# EAGLE design ded_pribor03-razmetlka (EAGLE 5.00)
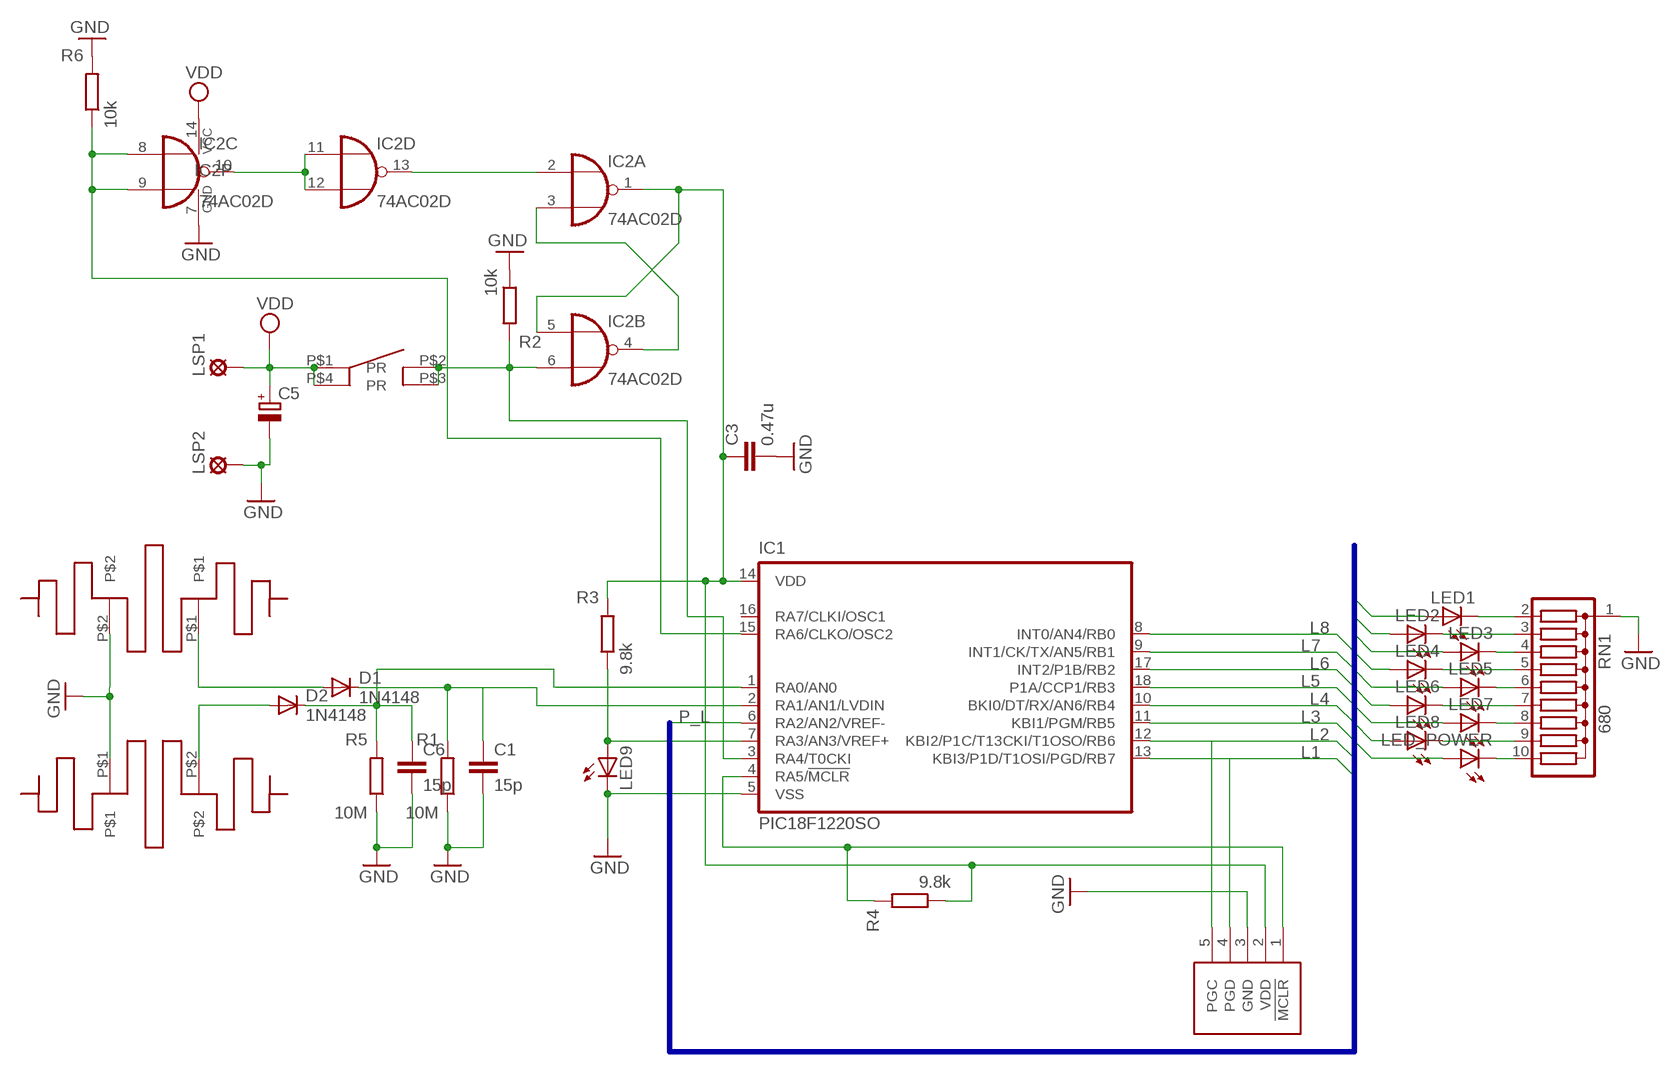
[diagram p0: schematic, sheet 1]

## Parts
C1  15p  C-EUC1206  [C1206]
C3  0.47u  C-EUC1206  [C1206]
C5  CPOL-EUSMCA  [SMC_A]
C6  15p  C-EUC1206  [C1206]
D1  1N4148  [DO35-10]
D2  1N4148  [DO35-10]
IC1  PIC18F1220SO  [SO-18W]
IC2  74AC02D  [SO14]
LED1  LED3MM  [LED3MM]
LED2  LED3MM  [LED3MM]
LED3  LED3MM  [LED3MM]
LED4  LED3MM  [LED3MM]
LED5  LED3MM  [LED3MM]
LED6  LED3MM  [LED3MM]
LED7  LED3MM  [LED3MM]
LED8  LED3MM  [LED3MM]
LED9  LED5MM  [LED5MM]
LED_POWER  LED3MM  [LED3MM]
LSP1  SE14  [SE14]
LSP2  SE14  [SE14]
R1  10M  R-EU_M1206  [M1206]
R2  10k  R-EU_M1206  [M1206]
R3  9.8k  R-EU_M1206  [M1206]
R4  9.8k  R-EU_M1206  [M1206]
R5  10M  R-EU_M1206  [M1206]
R6  10k  R-EU_M1206  [M1206]
RN1  680  G09R  [SIL10]
U$1  TIKBUTTON01  [TIKBUTTON01]
U$2  ANTENNA  [ANT!]
U$3  ANTENNA  [ANT!]
U$4  PIC-PROG-CON  [PIC-PROG-CON]

## Nets
GND [my_def]: C1.2 C3.2 C5.- C6.2 IC1.5(VSS) IC2.7(P:GND) LED9.K(C) LSP2.MP R1.1 R2.1 R5.1 R6.2 RN1.1 U$2.P$1 U$3.P$2 U$4.3(GND)
L1: IC1.13(KBI3/P1D/T1OSI/PGD/RB7) LED1.A U$4.4(PGD)
L2: IC1.12(KBI2/P1C/T13CKI/T1OSO/RB6) LED2.A U$4.5(PGC)
L3: IC1.11(KBI1/PGM/RB5) LED3.A
L4: IC1.10(BKI0/DT/RX/AN6/RB4) LED4.A
L5: IC1.18(P1A/CCP1/RB3) LED5.A
L6: IC1.17(INT2/P1B/RB2) LED6.A
L7: IC1.9(INT1/CK/TX/AN5/RB1) LED7.A
L8: IC1.8(INT0/AN4/RB0) LED8.A
N$1: C1.1 D1.C IC1.2(RA1/AN1/LVDIN) R1.2
N$2 [my_def]: C6.1 D2.C IC1.1(RA0/AN0) R5.2
N$3: LED1.K(C) RN1.2
N$4: LED2.K(C) RN1.3
N$5: LED3.K(C) RN1.4
N$6: LED4.K(C) RN1.5
N$7: LED5.K(C) RN1.6
N$8: LED6.K(C) RN1.7
N$9: LED7.K(C) RN1.8
N$10: LED8.K(C) RN1.9
N$11: LED_POWER.K(C) RN1.10
N$12: C3.1 IC1.14(VDD) IC2.1(A:O) IC2.5(B:I0) R3.2 R4.1 U$4.2(VDD)
N$13: IC2.3(A:I1) IC2.4(B:O)
N$14: D1.A U$3.P$1
N$15: IC2.2(A:I0) IC2.13(D:O)
N$16: IC1.3(RA4/T0CKI) IC2.6(B:I1) R2.2 U$1.P$2(R) U$1.P$3(R)
N$17: D2.A U$2.P$2
N$18: IC1.7(RA3/AN3/VREF+) LED9.A R3.1
N$22: IC2.10(C:O) IC2.11(D:I0) IC2.12(D:I1)
N$23: IC1.15(RA6/CLKO/OSC2) IC2.8(C:I0) IC2.9(C:I1) R6.1
N$24: IC1.4(RA5/!MCLR) R4.2 U$4.1(!MCLR)
P_L: IC1.6(RA2/AN2/VREF-) LED_POWER.A
VDD [my_def]: C5.+ IC2.14(P:VCC) LSP1.MP U$1.P$1(P) U$1.P$4(P)
Unconnected: IC1.16(RA7/CLKI/OSC1)

## Buses
L1,L2,L3,L4,L5,L6,L7,L8,P_L

## Library data of the parts
C1 C3 C6 = rcl:C-EU: CAPACITOR, European symbol
C5 = rcl:CPOL-EU: POLARIZED CAPACITOR, European symbol
D1 D2 = diode:1N4148: DIODE high speed (Philips)
IC1 = microchip:PIC18F1*20: 18/20/28-Pin High-Performance, Enhanced Flash Microcontrollers with 10-bit A/D and nanoWatt Technology Source: ww1.microchip.com/downloads/en/DeviceDoc/39605c.pdf
IC2 = 74xx-eu:74*02: Quad 2-input NOR gate
LED1-LED9 LED_POWER = led:LED: LED OSRAM: - CHIPLED LG R971, LG N971, LY N971, LG Q971, LY Q971, LO R971, LY R971 LH N974, LH R974 LS Q976, LO Q976, LY Q976 LO Q996 - Hyper CHIPLED LW Q18S LB Q993, LB Q99A, LB R99A - SideLED LS A670, LO A670, LY A670, LG A670, LP A670 LB A673, LV A673, LT A673, LW A673 LH A674 LY A675 LS A676, LA A676, LO A676, LY A676, LW A676 LS A679, LY A679, LG A679 - Hyper Micro SIDELED® LS Y876, LA Y876, LO Y876, LY Y876 LT Y87S - SmartLED LW L88C, LW L88S LB L89C, LB L89S, LG L890 LS L89K, LO L89K, LY L89K LS L896, LA L896, LO L896, LY L896 - TOPLED LS T670, LO T670, LY T670, LG T670, LP T670 LSG T670, LSP T670, LSY T670, LOP T670, LYG T670 LG T671, LOG T671, LSG T671 LB T673, LV T673, LT T673, LW T673 LH T674 LS T676, LA T676, LO T676, LY T676, LB T676, LH T676, LSB T676, LW T676 LB T67C, LV T67C, LT T67C, LS T67K, LO T67K, LY T67K, LW E67C LS E67B, LA E67B, LO E67B, LY E67B, LB E67C, LV E67C, LT E67C LW T67C LS T679, LY T679, LG T679 LS T770, LO T770, LY T770, LG T770, LP T770 LB T773, LV T773, LT T773, LW T773 LH T774 LS E675, LA E675, LY E675, LS T675 LS T776, LA T776, LO T776, LY T776, LB T776 LHGB T686 LT T68C, LB T68C - Hyper Mini TOPLED® LB M676 - Mini TOPLED Santana® LG M470 LS M47K, LO M47K, LY M47K Source: http://www.osram.convergy.de - LUMILED® LXK2-PW12-R00, LXK2-PW12-S00, LXK2-PW14-U00, LXK2-PW14-V00 LXK2-PM12-R00, LXK2-PM12-S00, LXK2-PM14-U00 LXK2-PE12-Q00, LXK2-PE12-R00, LXK2-PE12-S00, LXK2-PE14-T00, LXK2-PE14-U00 LXK2-PB12-K00, LXK2-PB12-L00, LXK2-PB12-M00, LXK2-PB14-N00, LXK2-PB14-P00, LXK2-PB14-Q00 LXK2-PR12-L00, LXK2-PR12-M00, LXK2-PR14-Q00, LXK2-PR14-R00 LXK2-PD12-Q00, LXK2-PD12-R00, LXK2-PD12-S00 LXK2-PH12-R00, LXK2-PH12-S00 LXK2-PL12-P00, LXK2-PL12-Q00, LXK2-PL12-R00 Source: www.luxeon.com
LSP1 LSP2 = solpad:SE14: SOLDER PAD E1553, drill 1,4mm, distributor Buerklin, 07F820
R1-R6 = rcl:R-EU_: RESISTOR, European symbol
RN1 = resistor-sil:G09R: SIL RESISTOR
U$1 = buttons:TIKBUTTON01: button tik
U$2 U$3 = antenna:ANTENNA: ANTENNA ded
U$4 = pic_prog_con:PIC-PROG-CON: pic prog con pic_prog pic_prog_con

## Net classes
2 net12: width 0.305 mm
3 my_def: width 0.508 mm

## Board
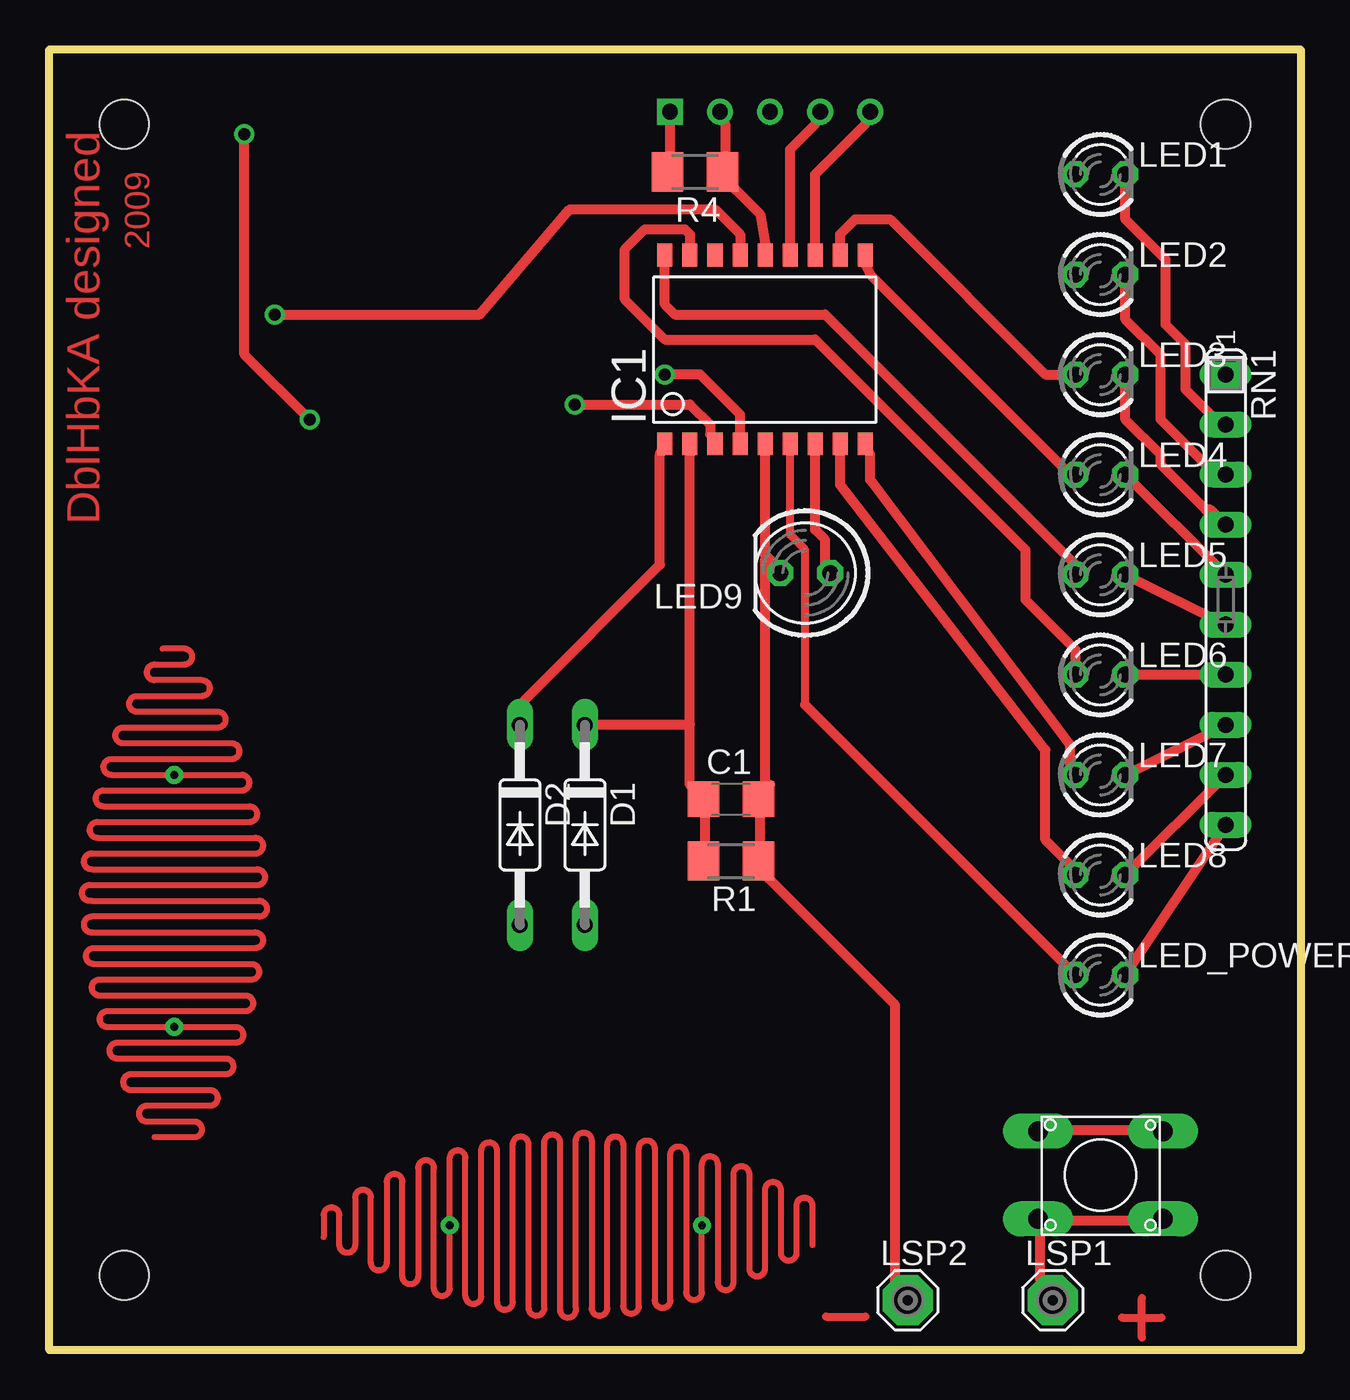
[diagram p1: board, top side]
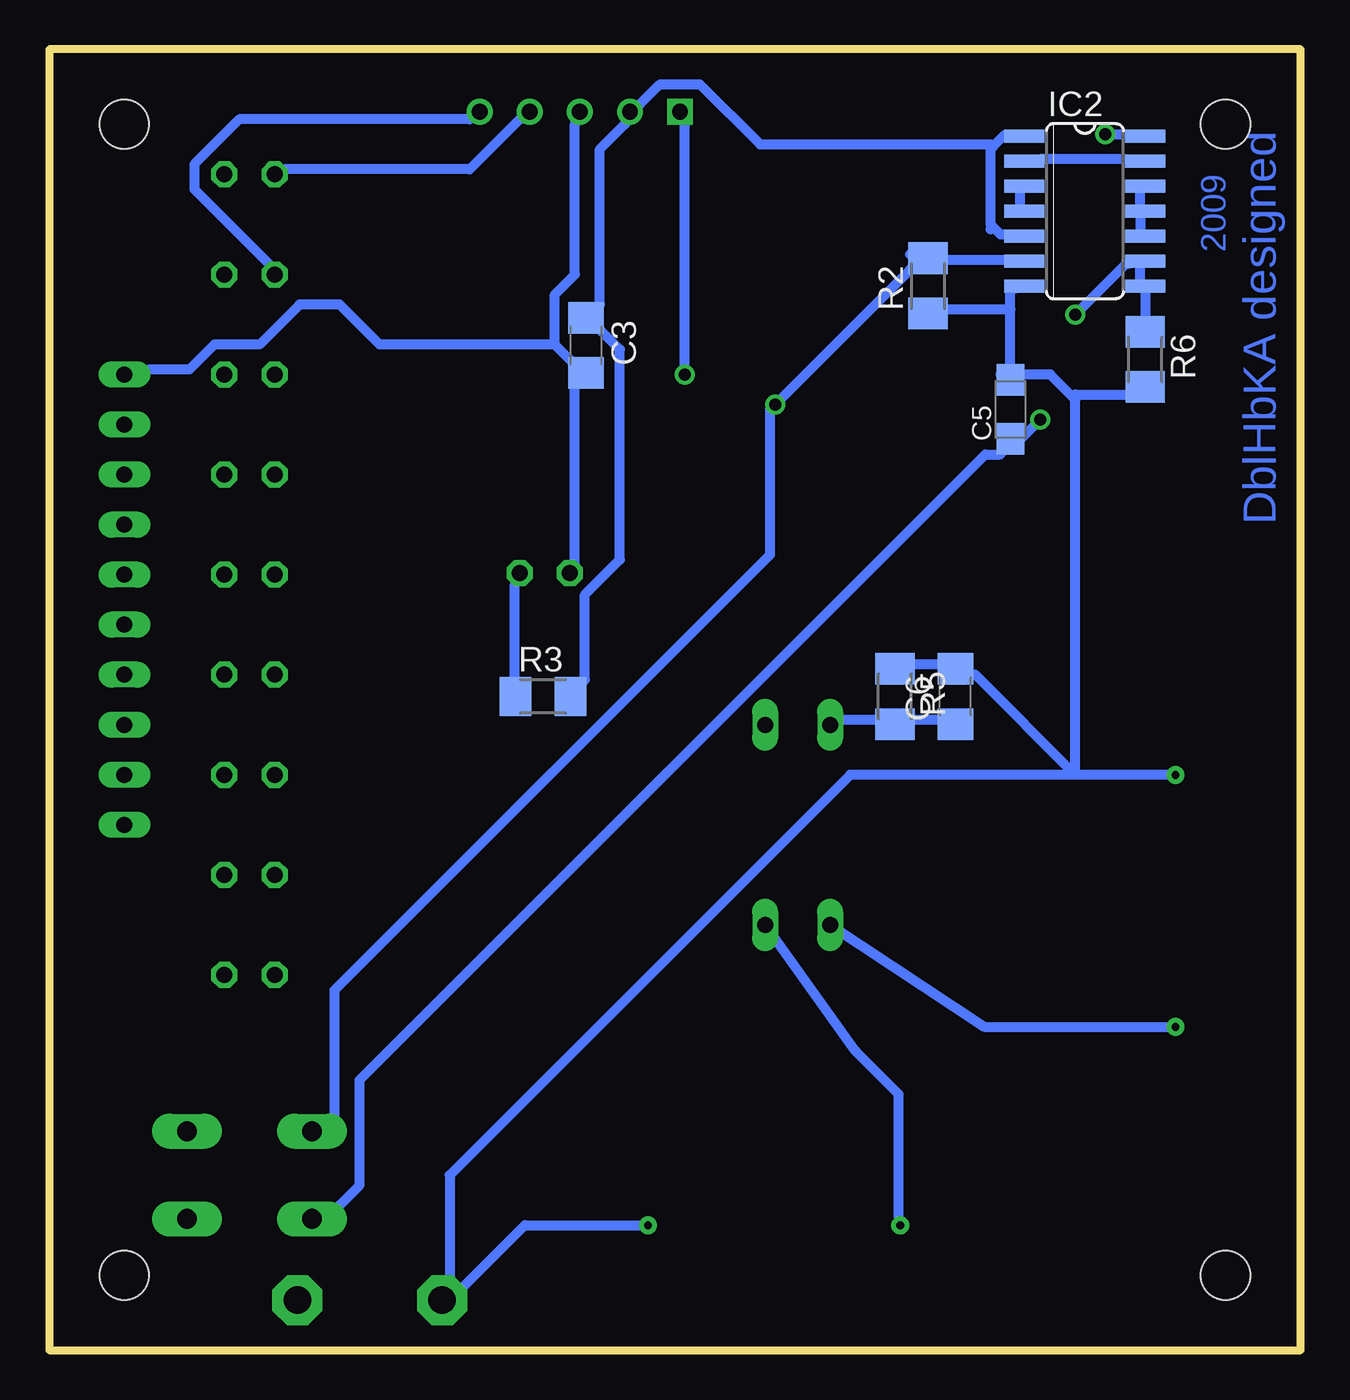
[diagram p2: board, bottom side, seen from below]

Size 63.5 x 66.04 mm. Coordinates in mm from the lower left corner, seen from the top.
Outline: 0,0 0,66.04 63.5,66.04 63.5,0 0,0
Copper layers (1*16): Top 0.035mm / dielectric 1.5mm / Bottom 0.035mm
Design rules "default *": minimum track width 20mil, minimum drill 24mil, track to track 20mil, track to pad 15mil, pad to pad 8mil, via to via 8mil, smd to smd 8mil, copper to edge 40mil, drill to drill 8mil, minimum pad ring 10mil, minimum via ring 8mil, stop-mask expansion 4mil, vias tented up to drill 0mil, thermal gap 10mil
Holes 2.5 mm at 3.81,3.81 3.81,62.23 59.69,3.81 59.69,62.23

### Footprints (pad centres in the part's own frame; a part is rotated, then mirrored left to right if it is on the bottom)
C1206 = smd 1.6 x 1.8: 1 -1.4,0; 2 1.4,0
SMC_A = smd 1.6 x 1.4: + -1.5,0; - 1.5,0
DO35-10 = drill 0.813 long: A 5.08,0; C -5.08,0
SO-18W = smd 0.762 x 1.143: 1 -5.08,-4.788; 2 -3.81,-4.788; 3 -2.54,-4.788; 4 -1.27,-4.788; 5 0,-4.788; 6 1.27,-4.788; 7 2.54,-4.788; 8 3.81,-4.788; 9 5.08,-4.788; 10 5.08,4.788; 11 3.81,4.788; 12 2.54,4.788; 13 1.27,4.788; 14 0,4.788; 15 -1.27,4.788; 16 -2.54,4.788; 17 -3.81,4.788; 18 -5.08,4.788
SO14 = smd 0.66 x 2.032: 1 -3.81,-3.073; 2 -2.54,-3.073; 3 -1.27,-3.073; 4 0,-3.073; 5 1.27,-3.073; 6 2.54,-3.073; 7 3.81,-3.073; 8 3.81,3.073; 9 2.54,3.073; 10 1.27,3.073; 11 0,3.073; 12 -1.27,3.073; 13 -2.54,3.073; 14 -3.81,3.073
LED3MM = drill 0.813 octagon: A -1.27,0; K 1.27,0
LED5MM = drill 0.813 octagon: A -1.27,0; K 1.27,0
SE14 = drill 1.397 pad 2.54 octagon: MP 0,0
M1206 = smd 1.6 x 2: 1 -1.4,0; 2 1.4,0
SIL10 = drill 0.813 long: 1 -11.43,0; 2 -8.89,0; 3 -6.35,0; 4 -3.81,0; 5 -1.27,0; 6 1.27,0; 7 3.81,0; 8 6.35,0; 9 8.89,0; 10 11.43,0
TIKBUTTON01 = drill 1 pad 1.778 long: P$1 -2.223,-3.175; P$2 2.223,-3.175; P$3 2.223,3.175; P$4 -2.223,3.175
ANT! = drill 0.4 pad 0.8 round: P$1 0,0; P$2 12.8,0
PIC-PROG-CON = drill 0.8 square: 1 -3.81,0 | drill 0.8 round: 2 -1.27,0; 3 1.27,0; 4 3.81,0; 5 6.35,0

### Placement (x,y rotation side)
C1  34.6,27.98 0 top
C3  36.27,51.01 270 bottom
C5  14.73,47.75 90 bottom
C6  17.53,33.19 90 bottom
D1  27.18,26.67 270 top
D2  23.88,26.67 270 top
IC1  36.32,50.8 0 top
IC2  10.95,57.82 270 bottom
LED1  53.34,59.69 0 top
LED2  53.34,54.61 0 top
LED3  53.34,49.53 0 top
LED4  53.34,44.45 0 top
LED5  53.34,39.37 0 top
LED6  53.34,34.29 0 top
LED7  53.34,29.21 0 top
LED8  53.34,24.13 0 top
LED9  38.36,39.45 180 top
LED_POWER  53.34,19.05 0 top
LSP1  50.91,2.54 0 top
LSP2  43.56,2.54 0 top
R1  34.6,24.84 180 top
R2  18.91,54.04 90 bottom
R3  38.44,33.19 0 bottom
R4  32.77,59.82 180 top
R5  20.59,33.19 270 bottom
R6  7.89,50.29 270 bottom
RN1  59.69,38.1 270 top
U$1  53.34,8.89 90 top
U$2  6.35,29.21 270 top
U$3  20.32,6.35 0 top
U$4  35.31,62.87 0 top

### Tracks (layer width: path | path; a pad name or v marks a point on that pad's centre or on a via)
GND
  Top 0.508: C1.2 36.58,28.7 | LSP2.MP 42.93,3.56 42.93,17.53 36.58,23.88 R1.1 36.07,25.65 36.07,27.18 C1.2 | 36.45,40.26 36.83,39.88 LED9.K | 36.45,40.26 36.32,40.39 36.32,45.47 IC1.5 | C1.2 36.32,28.7 36.32,40.13 36.45,40.26
  Bottom 0.508: R5.1 19.81,34.8 18.29,34.8 C6.2 17.78,34.29 16.51,34.29 11.43,29.21 | 14.73,52.83 14.73,53.85 IC2.7 | 14.73,52.83 C5.- 15.24,49.53 12.7,49.53 11.56,48.39 | 14.73,52.83 18.03,52.83 R2.1 | U$2.P$1 11.43,29.21 | 11.56,48.39 11.43,48.26 11.43,29.21 | 43.18,2.54 39.37,6.35 U$3.P$2 33.02,6.35 | 43.18,2.54 43.18,8.89 22.86,29.21 11.43,29.21 | 43.18,2.54 LSP2.MP | R6.2 8.64,48.51 11.43,48.51 11.56,48.39 | LED9.K 36.83,39.88 36.83,49.02 C3.2 37.08,50.29 37.85,51.05 | 37.85,51.05 37.85,53.59 36.83,54.61 36.83,62.23 U$4.3 | 37.85,51.05 46.74,51.05 48.77,53.09 50.8,53.09 52.83,51.05 55.12,51.05 56.39,49.78 58.42,49.78 RN1.1
L1
  Top 0.508: IC1.13 37.59,56.13 37.59,60.96 38.86,62.23 U$4.4
  Bottom 0.508: LED1.A 51.56,59.94 42.16,59.94 39.62,62.48 U$4.4
L2
  Top 0.508: IC1.12 38.86,56.13 38.86,59.69 41.4,62.23 U$4.5
  Bottom 0.508: LED2.A 52.32,55.12 56.13,58.93 56.13,60.2 53.85,62.48 42.16,62.48 U$4.5
L3
  Top 0.508: LED3.A 50.55,49.53 42.67,57.4 40.89,57.4 40.13,56.64 40.13,55.63 40.13,55.62 IC1.11
L4
  Top 0.508: IC1.10 41.4,55.12 41.66,54.61 51.56,44.7 LED4.A
L5
  Top 0.508: LED5.A 52.07,39.88 39.37,52.58 31.75,52.58 31.24,53.09 31.24,55.37 IC1.18
L6
  Top 0.508: IC1.17 32.51,56.64 32.26,56.9 30.23,56.9 29.21,55.88 29.21,53.34 31.24,51.31 38.86,51.31 49.53,40.64 49.53,38.1 52.07,35.56 LED6.A
L7
  Top 0.508: IC1.9 41.66,45.47 41.66,44.2 51.82,30.73 51.82,29.72 LED7.A
L8
  Top 0.508: IC1.8 40.13,45.47 40.13,43.94 50.55,30.48 50.55,25.91 51.82,24.64 LED8.A
N$1
  Top 0.508: 32.51,31.75 32.51,28.7 C1.1 33.27,27.18 33.27,25.65 R1.2 | 32.51,31.75 32.51,45.47 IC1.2 | 32.51,31.75 D1.C
N$2
  Top 0.508: IC1.1 30.99,45.47 30.99,39.88 24.13,33.02 D2.C
  Bottom 0.508: C6.1 18.29,32 19.81,32 R5.2 21.34,32 23.37,32 D2.C
N$3
  Top 0.508: LED1.K 54.61,57.4 56.64,55.37 56.64,52.07 57.66,51.05 57.66,48.77 59.44,46.99 RN1.2
N$4
  Top 0.508: LED2.K 54.61,52.32 56.39,50.55 56.39,47.24 59.18,44.45 RN1.3
N$5
  Top 0.508: LED3.K 54.61,47.24 56.39,45.47 56.39,44.96 58.67,42.67 58.93,42.67 RN1.4
N$6
  Top 0.508: RN1.5 LED4.K
N$7
  Top 0.508: LED5.K RN1.6
N$8
  Top 0.508: LED6.K RN1.7
N$9
  Top 0.508: LED7.K RN1.8
N$10
  Top 0.508: LED8.K RN1.9
N$11
  Top 0.508: LED_POWER.K RN1.10
N$12
  Top 0.508: IC1.14 36.32,56.13 36.07,57.66 34.8,58.93 R4.1 34.29,60.71 34.29,62.23 U$4.2
  Bottom 0.508: 15.62,57.02 15.75,57.15 15.75,60.96 15.62,61.09 | 15.62,57.02 15.24,56.64 14.99,56.64 IC2.5 | 15.62,61.09 14.99,61.72 IC2.1 | 15.62,57.02 15.75,56.9 | R3.2 36.32,34.04 36.32,38.35 34.54,40.13 34.54,50.8 35.56,51.82 C3.1 35.56,53.09 35.56,60.96 34.29,62.23 U$4.2 33.53,63.25 32.51,64.26 30.48,64.26 27.43,61.21 15.75,61.21 15.62,61.09
N$13
  Bottom 0.508: IC2.4 14.22,57.91 14.22,58.93 IC2.3
N$14
  Bottom 0.508: U$3.P$1 20.4,6.8 20.4,13 22.6,15.2 D1.A
N$15
  Bottom 0.508: IC2.13 8.89,60.45 13.21,60.45 IC2.2
N$16  (via drill 0.61)
  Top 0.508: U$1.P$3 51.82,11.18 54.86,11.18 U$1.P$2 | v26.67,48.01 32.51,48.01 33.53,46.99 33.53,46.48 IC1.3
  Bottom 0.508: R2.2 18.03,55.37 14.99,55.37 IC2.6 | R2.2 19.81,55.63 | R2.2 19.81,54.86 v26.67,48.01 26.92,47.75 26.92,40.39 49.02,18.29 49.02,11.94 U$1.P$3
N$17
  Bottom 0.508: U$2.P$2 6.8,16.4 16,16.4 D2.A
N$18
  Top 0.508: IC1.7 38.86,45.47 38.86,41.66 39.37,41.15 39.37,39.88 LED9.A
  Bottom 0.508: R3.1 39.88,34.04 39.88,38.86 LED9.A
N$19
  Top 0.406: 39.43,1.7 41.41,1.7
N$20
  Top 0.406: 54.44,1.65 56.44,1.65
N$21
  Top 0.406: 55.44,0.65 55.44,2.65
N$22
  Bottom 0.508: IC2.10 8.13,56.64 8.13,57.66 IC2.11 8.13,57.91 8.13,58.93 IC2.12
N$23  (via drill 0.61)
  Top 0.508: IC1.15 35.05,56.64 33.78,57.91 26.42,57.91 21.84,52.58 11.68,52.58 11.43,52.32 v11.43,52.58
  Bottom 0.508: v11.43,52.58 8.89,55.12 IC2.9 8.13,55.12 8.13,54.1 IC2.8 7.87,53.85 7.87,52.32 R6.1
N$24  (via drill 0.61)
  Top 0.508: IC1.4 35.05,46.48 35.05,47.5 33.02,49.53 v31.24,49.53 | R4.2 31.5,60.71 U$4.1
  Bottom 0.508: v31.24,49.53 31.24,62.23 U$4.1
P_L
  Top 0.406: IC1.6 37.59,41.4 38.35,40.64 38.35,32.77
  Top 0.508: LED_POWER.A 38.35,32.77
VDD  (via drill 0.61)
  Top 0.508: LSP1.MP 50.29,3.56 50.29,5.84 U$1.P$4 51.82,6.6 54.86,6.6 U$1.P$1 | v9.91,61.72 9.91,50.55 v13.21,47.24
  Bottom 0.508: U$1.P$4 48.77,7.37 47.75,8.38 47.75,13.72 16,45.47 15.24,45.47 C5.+ 14.22,46.23 v13.21,47.24 | v9.91,61.72 8.89,61.72 IC2.14

### Text on the board
Top: 2009 | DblHbKA designed
Bottom: 2009 | DblHbKA designed